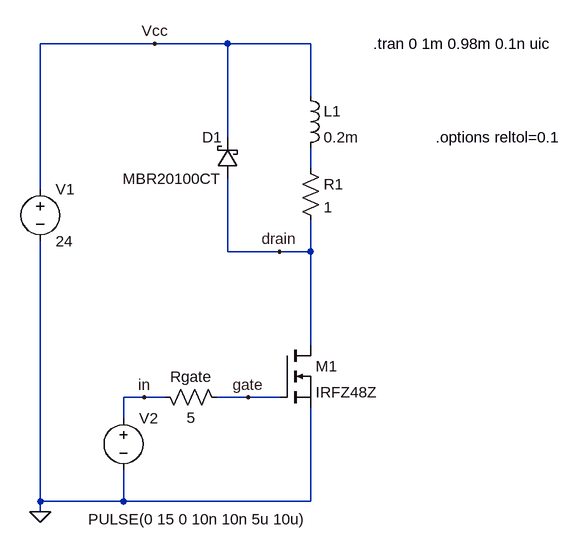
[diagram p0: schematic Mosfet_Switching.asc]
Mosfet_Switching.asc, the LTspice schematic file:
Version 4
SHEET 1 880 700
WIRE -32 -48 -208 -48
WIRE 80 -48 -32 -48
WIRE 208 -48 80 -48
WIRE 208 32 208 -48
WIRE 80 96 80 -48
WIRE 208 144 208 112
WIRE -208 176 -208 -48
WIRE 80 272 80 160
WIRE 160 272 80 272
WIRE 208 272 208 224
WIRE 208 272 160 272
WIRE 208 416 208 272
WIRE -48 496 -80 496
WIRE -16 496 -48 496
WIRE 112 496 64 496
WIRE 160 496 112 496
WIRE -80 528 -80 496
WIRE -208 656 -208 256
WIRE -80 656 -80 608
WIRE -80 656 -208 656
WIRE 208 656 208 512
WIRE 208 656 -80 656
WIRE -208 672 -208 656
FLAG -208 672 0
FLAG 112 496 gate
FLAG 160 272 drain
FLAG -32 -48 Vcc
FLAG -48 496 in
SYMBOL ind 192 16 R0
SYMATTR InstName L1
SYMATTR Value 0.2m
SYMBOL res 192 128 R0
SYMATTR InstName R1
SYMATTR Value 1
SYMBOL nmos 160 416 R0
SYMATTR InstName M1
SYMATTR Value IRFZ48Z
SYMBOL schottky 96 160 R180
WINDOW 0 24 64 Left 2
WINDOW 3 24 0 Left 2
SYMATTR InstName D1
SYMATTR Value MBR20100CT
SYMATTR Description Diode
SYMATTR Type diode
SYMBOL voltage -208 160 R0
WINDOW 123 0 0 Left 0
WINDOW 39 0 0 Left 0
SYMATTR InstName V1
SYMATTR Value 24
SYMBOL voltage -80 512 R0
WINDOW 3 -54 172 Left 2
WINDOW 123 0 0 Left 0
WINDOW 39 0 0 Left 0
SYMATTR Value PULSE(0 15 0 10n 10n 5u 10u)
SYMATTR InstName V2
SYMBOL res -32 480 M90
WINDOW 0 0 56 VBottom 2
WINDOW 3 32 56 VTop 2
SYMATTR InstName Rgate
SYMATTR Value 5
TEXT 304 -48 Left 2 !.tran 0 1m 0.98m 0.1n uic
TEXT 400 96 Left 2 !.options reltol=0.1

The netlist it stands for:
* Mosfet_Switching.asc
L1 Vcc N001 0.2m
R1 N001 drain 1
M1 drain gate 0 0 IRFZ48Z
D1 drain Vcc MBR20100CT
V1 Vcc 0 24
V2 in 0 PULSE(0 15 0 10n 10n 5u 10u)
Rgate in gate 5
.model D D
.lib standard.dio
.model NMOS NMOS
.model PMOS PMOS
.lib standard.mos
.tran 0 1m 0.98m 0.1n uic
.options reltol=0.1
.backanno
.end